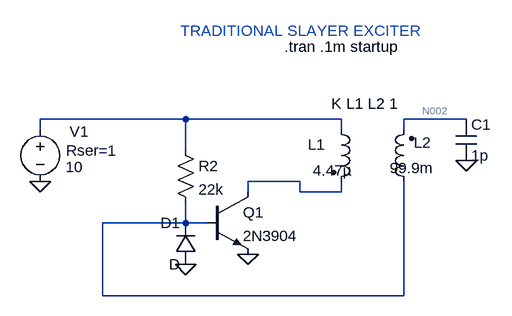
[diagram p0: schematic Slayer Exciter.asc]
Slayer Exciter.asc, the LTspice schematic file:
Version 4
SHEET 1 880 680
WIRE -112 80 -336 80
WIRE 128 80 -112 80
WIRE 320 80 224 80
WIRE -336 96 -336 80
WIRE 128 96 128 80
WIRE 224 96 224 80
WIRE -112 128 -112 80
WIRE 64 176 -16 176
WIRE -16 192 -16 176
WIRE 64 192 64 176
WIRE 128 192 128 176
WIRE 128 192 64 192
WIRE -112 240 -112 208
WIRE -112 240 -240 240
WIRE -80 240 -112 240
WIRE -240 352 -240 240
WIRE 224 352 224 176
WIRE 224 352 -240 352
FLAG -336 176 0
FLAG -16 288 0
FLAG -112 304 0
FLAG 320 144 0
SYMBOL voltage -336 80 R0
WINDOW 3 39 74 Left 2
WINDOW 123 0 0 Left 0
WINDOW 39 40 48 Left 2
WINDOW 0 45 19 Left 2
SYMATTR Value 10
SYMATTR SpiceLine Rser=1
SYMATTR InstName V1
SYMBOL ind2 112 80 R0
WINDOW 0 -36 39 Left 2
WINDOW 3 -28 79 Left 2
SYMATTR InstName L1
SYMATTR Value 4.47µ
SYMATTR Type ind
SYMBOL ind2 240 192 R180
WINDOW 0 -26 76 Left 2
WINDOW 3 -30 37 Left 2
SYMATTR InstName L2
SYMATTR Value 99.9m
SYMATTR Type ind
SYMBOL npn -80 192 R0
SYMATTR InstName Q1
SYMATTR Value 2N3904
SYMBOL res -128 112 R0
SYMATTR InstName R2
SYMATTR Value 22k
SYMBOL diode -96 304 R180
WINDOW 0 24 64 Left 2
WINDOW 3 24 0 Left 2
SYMATTR InstName D1
SYMBOL cap 304 80 R0
SYMATTR InstName C1
SYMATTR Value 1p
TEXT 40 -32 Left 2 !.tran .1m startup
TEXT 112 56 Left 2 !K L1 L2 1
TEXT -120 -56 Left 2 ;TRADITIONAL SLAYER EXCITER

The netlist it stands for:
* Slayer Exciter.asc
V1 N001 0 10 Rser=1
L1 N001 N003 4.47µ
L2 N004 N002 99.9m
Q1 N003 N004 0 0 2N3904
R2 N001 N004 22k
D1 0 N004 D
C1 N002 0 1p
.model D D
.lib standard.dio
.model NPN NPN
.model PNP PNP
.lib standard.bjt
.tran .1m startup
K L1 L2 1
* TRADITIONAL SLAYER EXCITER
.backanno
.end

* Results of the author's LTspice run, read from the files saved beside the schematic
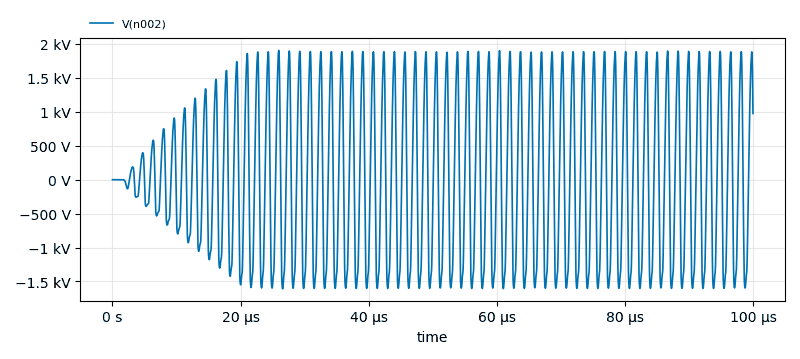
[diagram p1: Transient Analysis of Slayer Exciter.asc, plotted from the saved traces]
* Transient Analysis, 1 run:
*   V(n002): min -1.608 kV, max 1.905 kV, average -1.797 V, rms 1.187 kV, last 974.6 V